# EAGLE design LNA_v3 (EAGLE 7.7.0)
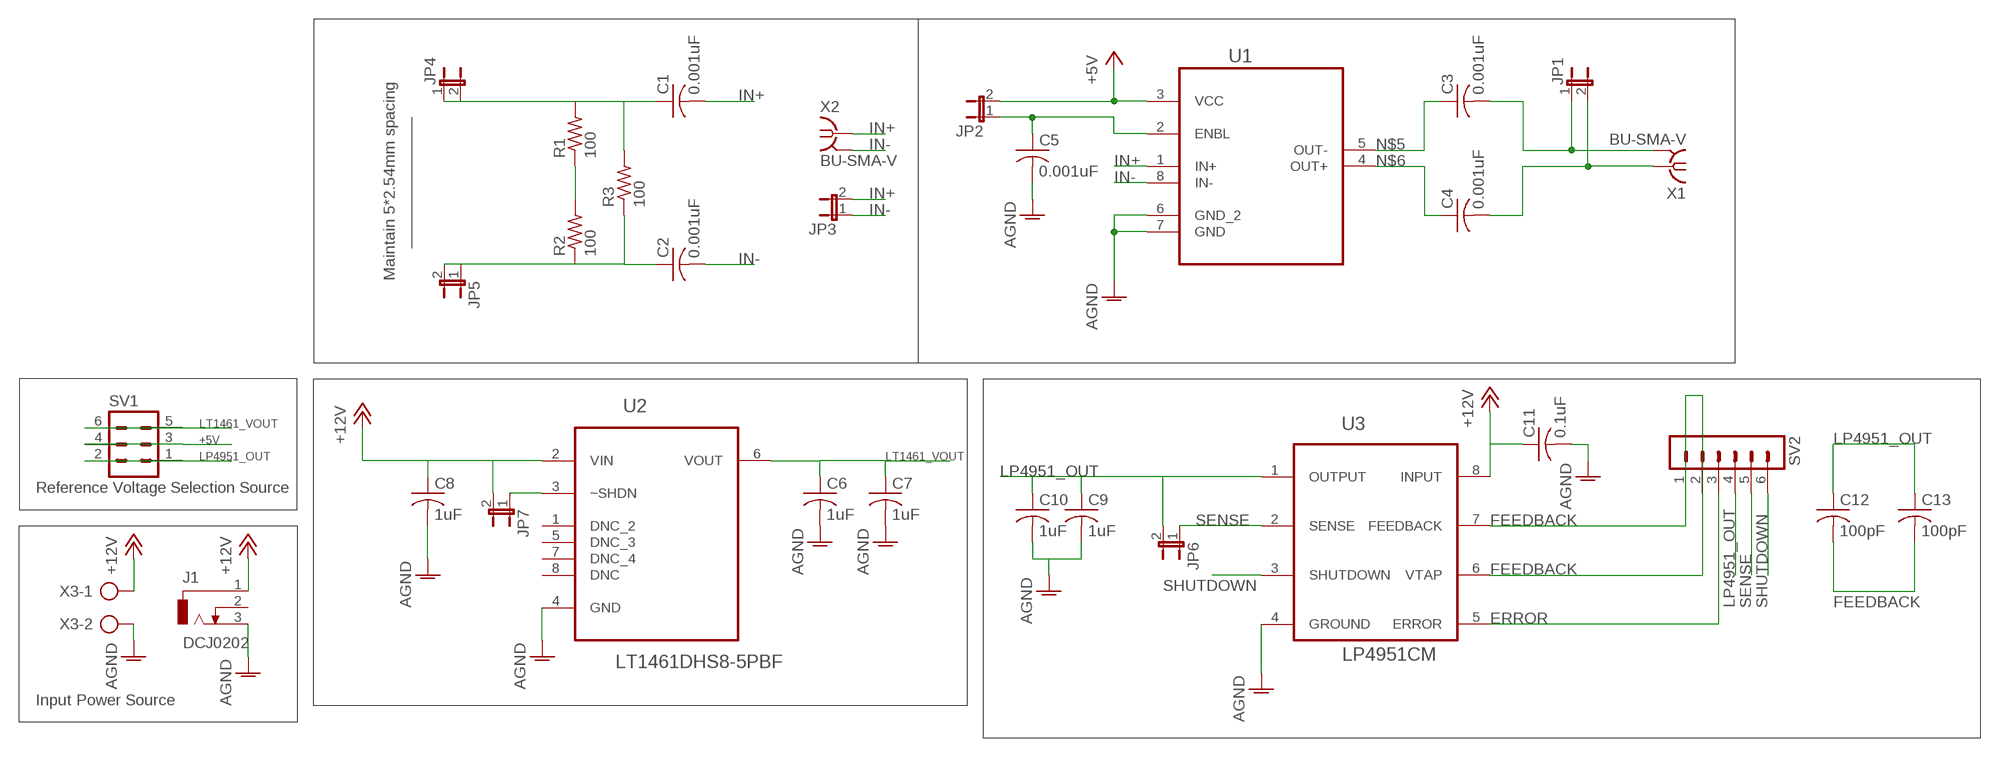
[diagram p0: schematic, sheet 1]

## Parts
C1  0.001uF  C-USC0805  [C0805]
C2  0.001uF  C-USC0805  [C0805]
C3  0.001uF  C-USC0805  [C0805]
C4  0.001uF  C-USC0805  [C0805]
C5  0.001uF  C-USC0805  [C0805]
C6  1uF  C-USC0805  [C0805]
C7  1uF  C-USC0805  [C0805]
C8  1uF  C-USC0805  [C0805]
C9  1uF  C-USC0805  [C0805]
C10  1uF  C-USC0805  [C0805]
C11  0.1uF  C-USC0805  [C0805]
C12  100pF  C-USC0805  [C0805]
C13  100pF  C-USC0805  [C0805]
J1  DCJ0202  [DCJ0202]
JP1  JP1E  [JP1]
JP2  JP1E  [JP1]
JP3  JP1E  [JP1]
JP4  JP1E  [JP1]
JP5  JP1E  [JP1]
JP6  JP1E  [JP1]
JP7  JP1E  [JP1]
R1  100  R-US_R0805  [R0805]
R2  100  R-US_R0805  [R0805]
R3  100  R-US_R0805  [R0805]
SV1  MA03-2  [MA03-2]
SV2  MA06-1  [MA06-1]
U1  AD8350ARMZ20  [SOP65P490X110-8N]
U2  LT1461DHS8-5PBF  [SOIC127P600X175-8N]
U3  LP4951CM  [SOIC127P600X175-8N]
X1  BU-SMA-V  [BU-SMA-V]
X2  BU-SMA-V  [BU-SMA-V]
X3  AK500/2  [AK500/2]

## Nets
+5V: JP2.2 SV1.3 SV1.4 U1.3(VCC)
+12V: C8.1 C11.1 J1.1 JP7.2 U2.2(VIN) U3.8(INPUT) X3.1
AGND: C5.2 C6.2 C7.2 C8.2 C9.2 C10.2 C11.2 J1.3 U1.6(GND_2) U1.7(GND) U2.4(GND) U3.4(GROUND) X3.2
ERROR: SV2.3 U3.5(ERROR)
FEEDBACK: C12.2 C13.2 SV2.1 SV2.2 U3.6(VTAP) U3.7(FEEDBACK)
IN+: C1.2 JP3.2 U1.1(IN+) X2.1
IN-: C2.2 JP3.1 U1.8(IN-) X2.2 X2.3 X2.4 X2.5
LP4951_OUT: C9.1 C10.1 C12.1 C13.1 JP6.2 SV1.1 SV1.2 SV2.4 U3.1(OUTPUT)
LT1461_VOUT: C6.1 C7.1 SV1.5 SV1.6 U2.6(VOUT)
N$1: C1.1 JP4.1 JP4.2 R1.2 R3.2
N$2: R1.1 R2.2
N$3: C5.1 JP2.1 U1.2(ENBL)
N$4: C2.1 JP5.1 JP5.2 R2.1 R3.1
N$5: C3.1 U1.5(OUT-)
N$6: C4.1 U1.4(OUT+)
N$7: JP7.1 U2.3(~SHDN)
OUT+: C4.2 JP1.2 X1.1
OUT-: C3.2 JP1.1 X1.2 X1.3 X1.4 X1.5
SENSE: JP6.1 SV2.5 U3.2(SENSE)
SHUTDOWN: SV2.6 U3.3(SHUTDOWN)
Unconnected: J1.2 U2.1(DNC_2) U2.5(DNC_3) U2.7(DNC_4) U2.8(DNC)

## Notes on the sheet
- Maintain 5*2.54mm spacing
- Reference Voltage Selection Source
- Input Power Source

## Library data of the parts
C1-C13 = rcl:C-US: CAPACITOR, American symbol
J1 = con-jack:DCJ0202: DC POWER JACK Source: DCJ0202.pdf; OC_FARNELL: unknown; OC_NEWARK: unknown
JP1-JP7 = jumper:JP1E: JUMPER
R1-R3 = rcl:R-US_: RESISTOR, American symbol
SV1 = con-lstb:MA03-2: PIN HEADER; OC_FARNELL: unknown; OC_NEWARK: unknown
SV2 = con-lstb:MA06-1: PIN HEADER; OC_FARNELL: unknown; OC_NEWARK: unknown
U1 = AD8350ARMZ20:AD8350ARMZ20: 1.0 GHz Differential Amplifier; MPN: AD8350ARMZ20; OC_FARNELL: 1438867; OC_NEWARK: 59K6657; PACKAGE: 8-Lead microSOIC; SUPPLIER: Analog Devices
U2 = LTC_By_element14_Batch_1:LT1461DHS8-5PBF: Micropower Precision Low Dropout Series Voltage Reference Family; MPN: LT1461DHS8-5#PBF; OC_FARNELL: 1663431; OC_NEWARK: 57M4326; PACKAGE: SOIC-8; SUPPLIER: Linear Technology
U3 = LP4951C:LP4951CM: Precision Adjustable Reference; MPN: LP4951CM; PACKAGE: SOIC-8; SUPPLIER: Texas Instruments
X1 X2 = con-coax:BU-SMA-V: FEMALE SMA CONNECTOR Radiall distributor RS 112-3794; OC_FARNELL: unknown; OC_NEWARK: unknown
X3 = con-ptr500:AK500/2: CONNECTOR; OC_FARNELL: unknown; OC_NEWARK: unknown

## Board
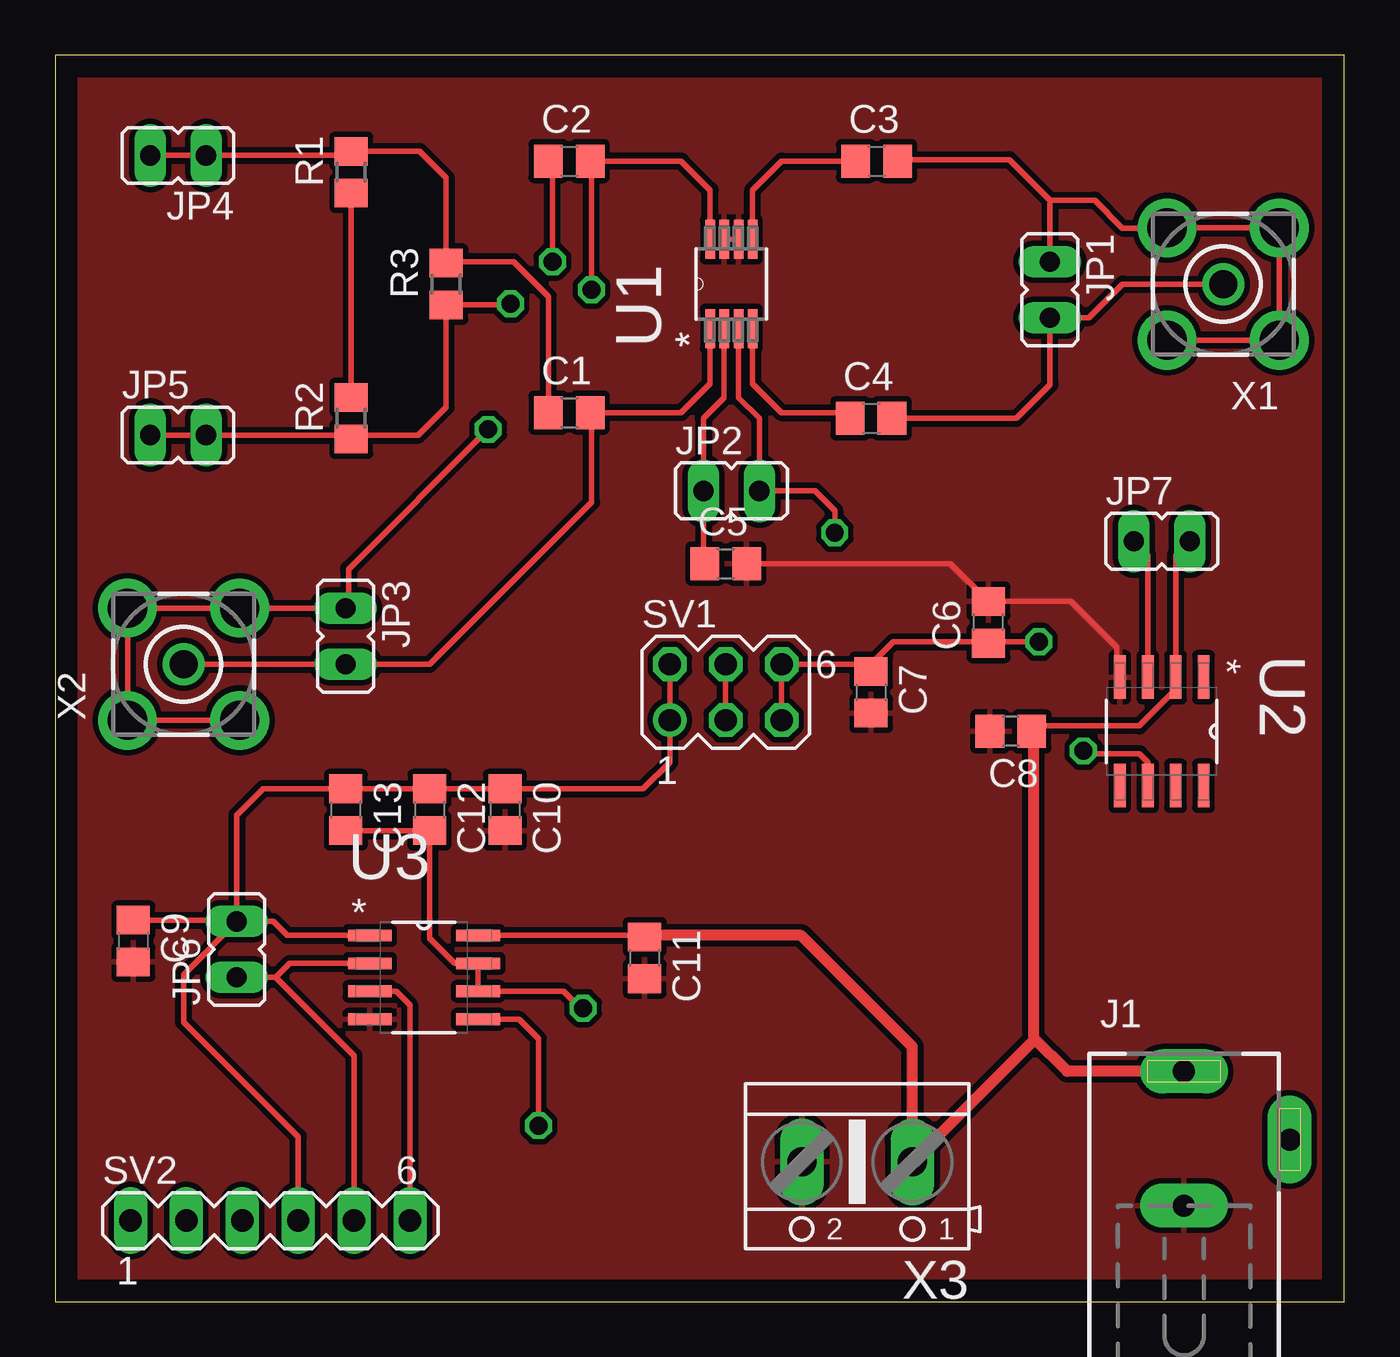
[diagram p1: board, top side]
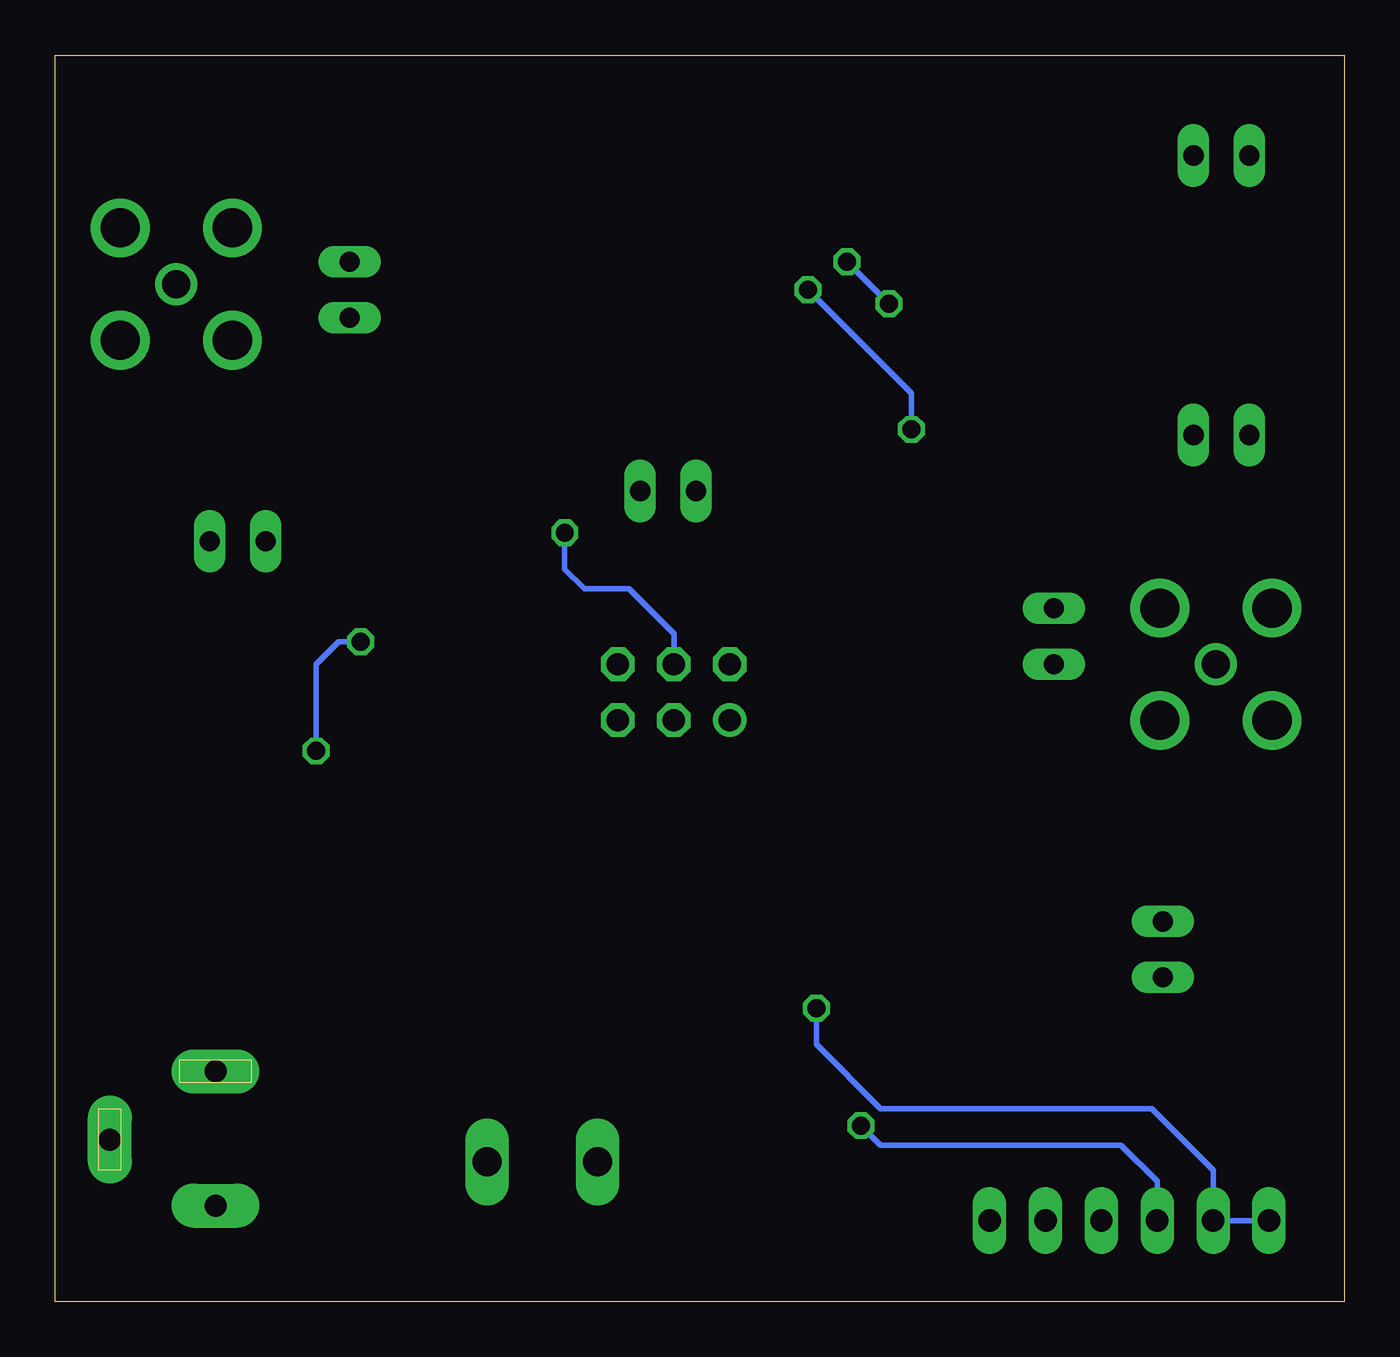
[diagram p2: board, bottom side, seen from below]

Size 58.6 x 56.63 mm. Coordinates in mm from the lower left corner, seen from the top.
Outline: 0,0 58.6,0 58.6,56.63 0,56.63 0,0
Copper layers (1*16): Top 0.035mm / dielectric 1.5mm / Bottom 0.035mm
Design rules "default *": minimum track width 10mil, minimum drill 24mil, track to track 10mil, track to pad 10mil, pad to pad 10mil, via to via 10mil, smd to smd 10mil, copper to edge 40mil, drill to drill 8mil, minimum pad ring 10mil, minimum via ring 8mil, stop-mask expansion 4mil, vias tented up to drill 0mil, thermal gap 10mil

### Footprints (pad centres in the part's own frame; a part is rotated, then mirrored left to right if it is on the bottom)
C0805 = smd 1.3 x 1.5: 1 -0.95,0; 2 0.95,0
DCJ0202 = drill 1 pad 2 long: 1 0,3.1; 2 4.8,0; 3 0,-3
JP1 = drill 0.914 long: 1 0,-1.27; 2 0,1.27
R0805 = smd 1.3 x 1.5: 1 -0.95,0; 2 0.95,0
MA03-2 = drill 1.016: 1 -2.54,-1.27 | drill 1.016 octagon: 2 -2.54,1.27; 3 0,-1.27; 4 0,1.27; 5 2.54,-1.27; 6 2.54,1.27
MA06-1 = drill 1.016 long: 1 -6.35,0; 2 -3.81,0; 3 -1.27,0; 4 1.27,0; 5 3.81,0; 6 6.35,0
SOP65P490X110-8N = smd 1.778 x 0.432: 1 -2.032,0.965; 2 -2.032,0.33; 3 -2.032,-0.33; 4 -2.032,-0.965; 5 2.032,-0.965; 6 2.032,-0.33; 7 2.032,0.33; 8 2.032,0.965
SOIC127P600X175-8N = smd 1.981 x 0.533: 1 -2.464,1.905; 2 -2.464,0.635; 3 -2.464,-0.635; 4 -2.464,-1.905; 5 2.464,-1.905; 6 2.464,-0.635; 7 2.464,0.635; 8 2.464,1.905
BU-SMA-V = drill 1.27: 1 0,0 | drill 1.778: 2 -2.55,2.55; 3 2.55,2.55; 4 2.55,-2.55; 5 -2.55,-2.55
AK500/2 = drill 1.321 long: 1 -2.515,0; 2 2.515,0

### Placement (x,y rotation side)
C1  23.37,40.39 0 top
C2  23.37,51.82 0 top
C3  37.34,51.82 0 top
C4  37.08,40.13 0 top
C5  30.48,33.53 0 top
C6  42.42,30.86 90 top
C7  37.08,27.69 270 top
C8  43.43,25.91 180 top
C9  3.56,16.38 270 top
C10  20.45,22.35 270 top
C11  26.8,15.62 270 top
C12  17.02,22.35 270 top
C13  13.21,22.35 270 top
J1  51.31,7.37 0 top
JP1  45.21,45.97 180 top
JP2  30.73,36.83 270 top
JP3  13.21,30.23 180 top
JP4  5.59,52.07 90 top
JP5  5.59,39.37 270 top
JP6  8.26,16 0 top
JP7  50.29,34.54 270 top
R1  13.46,51.31 90 top
R2  13.46,40.13 90 top
R3  17.78,46.23 90 top
SV1  30.48,27.69 0 top
SV2  9.78,3.68 0 top
U1  30.73,46.23 90 top
U2  50.29,25.91 270 top
U3  16.76,14.73 0 top
X1  53.09,46.23 180 top
X2  5.84,28.96 90 top
X3  36.45,6.35 180 top

### Tracks (layer width: path | path; a pad name or v marks a point on that pad's centre or on a via)
+5V  (via drill 0.81)
  Top 0.254: U1.3 31.06,41.07 32,40.13 JP2.2 34.54,36.83 35.43,35.94 v35.43,34.92 | SV1.3 SV1.4
  Bottom 0.254: v35.43,34.92 35.43,33.27 34.54,32.38 32.51,32.38 30.48,30.35 SV1.4
+12V
  Top 0.254: JP7.2 50.93,33.91 U2.2 50.93,27.81 49.28,26.16 44.64,26.16 C8.1 44.47,25.82 44.47,25.38 | U3.8 26.73,16.64 C11.1
  Top 0.508: J1.1 46,10.47 44.47,12 | 44.47,25.38 44.47,12 | 44.47,12 44.47,11.85 X3.1 38.96,11.58 33.91,16.64 26.86,16.64 C11.1
AGND
  Top 0.254: U1.6 U1.7 | C5.2 40.7,33.53 C6.2 46.17,31.81 48.26,29.72 48.26,28.5 U2.4
  pour Top: 0,0 0,56.64 58.67,56.64 58.67,0
ERROR  (via drill 0.81)
  Top 0.254: U3.5 21.08,12.83 21.97,11.94 v21.97,8
  Bottom 0.254: SV2.3 8.51,5.46 10.16,7.11 21.08,7.11 v21.97,8
FEEDBACK  (via drill 0.81)
  Top 0.254: C13.2 C12.2 17.02,16.51 18.16,15.37 U3.7 U3.6 23.11,14.1 23.88,13.34 v24,13.34
  Bottom 0.254: SV2.1 SV2.2 5.97,5.97 8.76,8.76 21.08,8.76 24,11.68 v24,13.34
IN+
  Top 0.254: U1.1 29.77,41.71 28.45,40.39 C1.2 24.38,40.32 24.38,36.32 17.02,28.96 JP3.2 X2.1
IN-  (via drill 0.81)
  Top 0.254: U1.8 29.77,50.49 28.45,51.82 C2.2 24.38,51.75 v24.38,45.97 | X2.5 X2.2 X2.3 X2.4 13.2,31.51 JP3.1 13.34,31.62 13.34,33.27 v19.68,39.62
  Bottom 0.254: v19.68,39.62 19.68,41.27 v24.38,45.97
LP4951_OUT
  Top 0.254: C9.1 8.19,17.33 JP6.2 | JP6.2 9.91,17.27 10.54,16.64 U3.1 | SV1.2 SV1.1 27.94,24.51 26.73,23.3 C10.1 C12.1 C13.1 9.46,23.3 8.26,22.1 JP6.2 | SV2.4 11.05,7.49 5.84,12.7 5.84,14.86 JP6.2
LT1461_VOUT  (via drill 0.81)
  Top 0.254: 42.1,30.23 C6.1 | SV1.5 SV1.6 36.76,28.96 C7.1 37.08,28.96 38.1,29.97 42.36,29.97 C6.1 | v44.7,29.97 42.48,29.97 C6.1 | U2.6 49.66,24.51 49.28,24.89 46.86,24.89 v46.74,25.02
  Bottom 0.254: v44.7,29.97 45.72,29.97 46.74,28.96 v46.74,25.02
N$1
  Top 0.254: JP4.2 JP4.1 13.27,52.07 R1.2 16.58,52.26 17.78,51.05 R3.2 17.85,47.24 20.83,47.24 22.42,45.65 C1.1
N$2
  Top 0.254: R1.1 R2.2
N$3
  Top 0.254: U1.2 30.4,41.07 29.46,40.13 JP2.1 29.46,33.59 C5.1
N$4  (via drill 0.81)
  Top 0.254: JP5.1 JP5.2 13.27,39.37 | 13.27,39.37 R2.1 | 13.27,39.37 16.51,39.37 17.78,40.64 R3.1 20.64,45.28 v20.7,45.34 | v22.61,47.24 22.61,51.63 C2.1
  Bottom 0.254: v20.7,45.34 v22.61,47.24
N$5
  Top 0.254: U1.5 31.7,50.49 33.02,51.82 C3.1
N$6
  Top 0.254: U1.4 31.7,41.71 33.02,40.39 35.88,40.39 C4.1
N$7
  Top 0.254: U2.3 49.66,33.91 JP7.1
OUT+
  Top 0.254: C4.2 43.69,40.13 45.21,41.66 JP1.2 46.99,44.7 48.51,46.23 X1.1
OUT-
  Top 0.254: C3.2 38.35,51.88 43.37,51.88 45.21,50.04 | 45.21,50.04 JP1.1 | X1.3 X1.2 X1.5 X1.4 50.53,48.77 48.51,48.77 47.24,50.04 45.21,50.04
SENSE
  Top 0.254: JP6.1 10.03,14.73 | 10.03,14.73 10.67,15.37 U3.2 | SV2.5 13.59,11.18 10.03,14.73
SHUTDOWN
  Top 0.254: SV2.6 16.13,13.46 15.49,14.1 U3.3